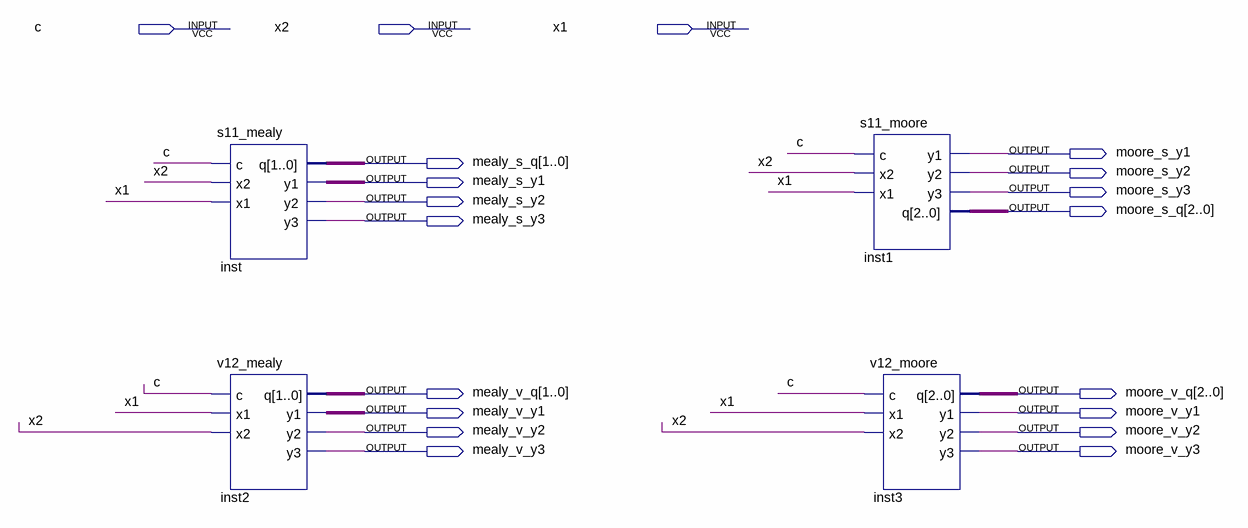
[diagram p0: schematic sheet]
// Quartus schematic sv12.bdf as structural Verilog: 4 symbols, 19 pins
module sv12 (
  input  c,
  input  x2,
  input  x1,
  output moore_s_y1,
  output [1:0] mealy_s_q,
  output moore_s_y2,
  output mealy_s_y1,
  output moore_s_y3,
  output mealy_s_y2,
  output [2:0] moore_s_q,
  output mealy_s_y3,
  output [1:0] mealy_v_q,
  output [2:0] moore_v_q,
  output mealy_v_y1,
  output moore_v_y1,
  output mealy_v_y2,
  output moore_v_y2,
  output mealy_v_y3,
  output moore_v_y3
);

  s11_mealy inst (.c(c), .x2(x2), .x1(x1), .q(mealy_s_q), .y1(mealy_s_y1), .y2(mealy_s_y2), .y3(mealy_s_y3));
  v12_mealy inst2 (.c(c), .x1(x1), .x2(x2), .q(mealy_v_q), .y1(mealy_v_y1), .y2(mealy_v_y2), .y3(mealy_v_y3));
  s11_moore inst1 (.c(c), .x2(x2), .x1(x1), .y1(moore_s_y1), .y2(moore_s_y2), .y3(moore_s_y3), .q(moore_s_q));
  v12_moore inst3 (.c(c), .x1(x1), .x2(x2), .q(moore_v_q), .y1(moore_v_y1), .y2(moore_v_y2), .y3(moore_v_y3));
endmodule
